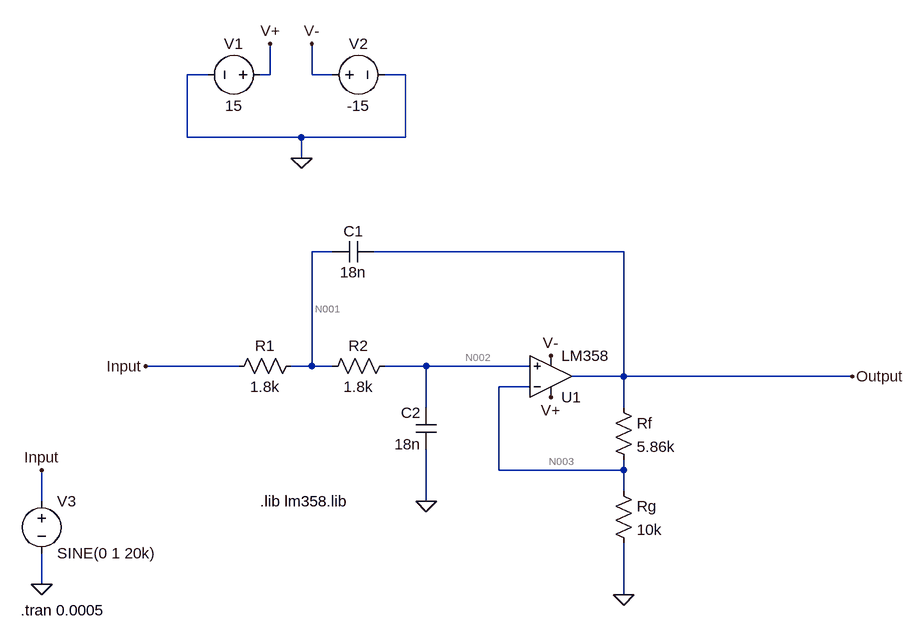
[diagram p0: schematic Tutorial.asc]
Tutorial.asc, the LTspice schematic file:
Version 4
SHEET 1 1124 680
WIRE 32 -288 0 -288
WIRE 128 -288 128 -336
WIRE 128 -288 112 -288
WIRE 192 -288 192 -336
WIRE 224 -288 192 -288
WIRE 336 -288 304 -288
WIRE 0 -192 0 -288
WIRE 176 -192 0 -192
WIRE 336 -192 336 -288
WIRE 336 -192 176 -192
WIRE 176 -160 176 -192
WIRE 224 -16 192 -16
WIRE 672 -16 288 -16
WIRE 80 160 -64 160
WIRE 192 160 192 -16
WIRE 192 160 160 160
WIRE 224 160 192 160
WIRE 368 160 304 160
WIRE 528 160 368 160
WIRE 672 176 672 -16
WIRE 672 176 592 176
WIRE 1024 176 672 176
WIRE 528 192 480 192
WIRE 368 224 368 160
WIRE 672 224 672 176
WIRE 480 320 480 192
WIRE 672 320 672 304
WIRE 672 320 480 320
WIRE 672 352 672 320
WIRE -224 368 -224 320
WIRE 368 368 368 288
WIRE -224 496 -224 448
WIRE 672 512 672 432
FLAG 368 368 0
FLAG -64 160 Input
FLAG 1024 176 Output
FLAG 672 512 0
FLAG 176 -160 0
FLAG 128 -336 V+
FLAG 192 -336 V-
FLAG 560 208 V+
FLAG 560 144 V-
FLAG -224 496 0
FLAG -224 320 Input
SYMBOL res 176 144 R90
WINDOW 0 0 56 VBottom 2
WINDOW 3 32 56 VTop 2
SYMATTR InstName R1
SYMATTR Value 1.8k
SYMBOL res 320 144 R90
WINDOW 0 0 56 VBottom 2
WINDOW 3 32 56 VTop 2
SYMATTR InstName R2
SYMATTR Value 1.8k
SYMBOL cap 288 -32 R90
WINDOW 0 0 32 VBottom 2
WINDOW 3 32 32 VTop 2
SYMATTR InstName C1
SYMATTR Value 18n
SYMBOL cap 384 288 R180
WINDOW 0 24 56 Left 2
WINDOW 3 24 8 Left 2
SYMATTR InstName C2
SYMATTR Value 18n
SYMBOL OpAmps\\opamp2 560 240 M180
SYMATTR InstName U1
SYMATTR Value LM358
SYMBOL res 656 208 R0
SYMATTR InstName Rf
SYMATTR Value 5.86k
SYMBOL res 656 336 R0
SYMATTR InstName Rg
SYMATTR Value 10k
SYMBOL voltage 128 -288 R90
WINDOW 0 -32 56 VBottom 2
WINDOW 3 32 56 VTop 2
WINDOW 123 0 0 Left 0
WINDOW 39 0 0 Left 0
SYMATTR InstName V1
SYMATTR Value 15
SYMBOL voltage 208 -288 R270
WINDOW 0 32 56 VTop 2
WINDOW 3 -32 56 VBottom 2
WINDOW 123 0 0 Left 0
WINDOW 39 0 0 Left 0
SYMATTR InstName V2
SYMATTR Value -15
SYMBOL voltage -224 352 R0
WINDOW 123 0 0 Left 0
WINDOW 39 0 0 Left 0
SYMATTR InstName V3
SYMATTR Value SINE(0 1 20k)
TEXT 112 368 Left 2 !.lib lm358.lib
TEXT -256 536 Left 2 !.tran 0.0005

The netlist it stands for:
* Tutorial.asc
R1 N001 Input 1.8k
R2 N002 N001 1.8k
C1 Output N001 18n
C2 0 N002 18n
XU1 N002 N003 V+ V- Output LM358  ; pins In+ In- V+ V- OUT
Rf Output N003 5.86k
Rg N003 0 10k
V1 V+ 0 15
V2 V- 0 -15
V3 Input 0 SINE(0 1 20k)
.lib lm358.lib
.tran 0.0005
.backanno
.end

* Results of the author's LTspice run, read from the files saved beside the schematic
* Operating Point, zero values left out:
*   V(n001) = 36 µV
*   V(n002) = 72 µV
*   V(output) = 4.777 mV
*   V(v+) = 15 V
*   V(v-) = -15 V
*   V(n003) = 3.078 mV
*   I(Rg) = 307.8 nA
*   I(Rf) = 289.8 nA
*   I(R2) = 20 nA
*   I(R1) = 20 nA
*   I(V3) = 20 nA
*   I(V2) = 350 µA
*   I(V1) = -350.3 µA
*   Ix(u1:IN+) = -20 nA
*   Ix(u1:IN-) = -18 nA
*   Ix(u1:VCC) = 350.3 µA
*   Ix(u1:VEE) = -350 µA
*   Ix(u1:OUT) = -289.8 nA
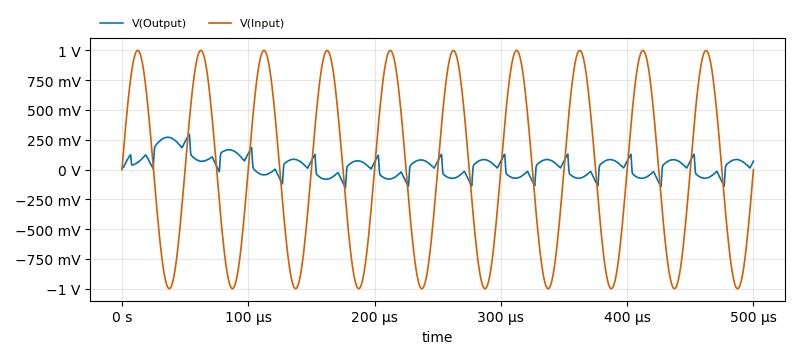
[diagram p1: Transient Analysis of Tutorial.asc, plotted from the saved traces]
* Transient Analysis, 1 run:
*   V(Output): min -152.2 mV, max 296.3 mV, average 30.53 mV, rms 92.25 mV, last 71 mV
*   V(Input): min -1 V, max 1 V, average 65.39 µV, rms 706.8 mV, last 0 V